# EAGLE design LED Leg (EAGLE 7.5.0)
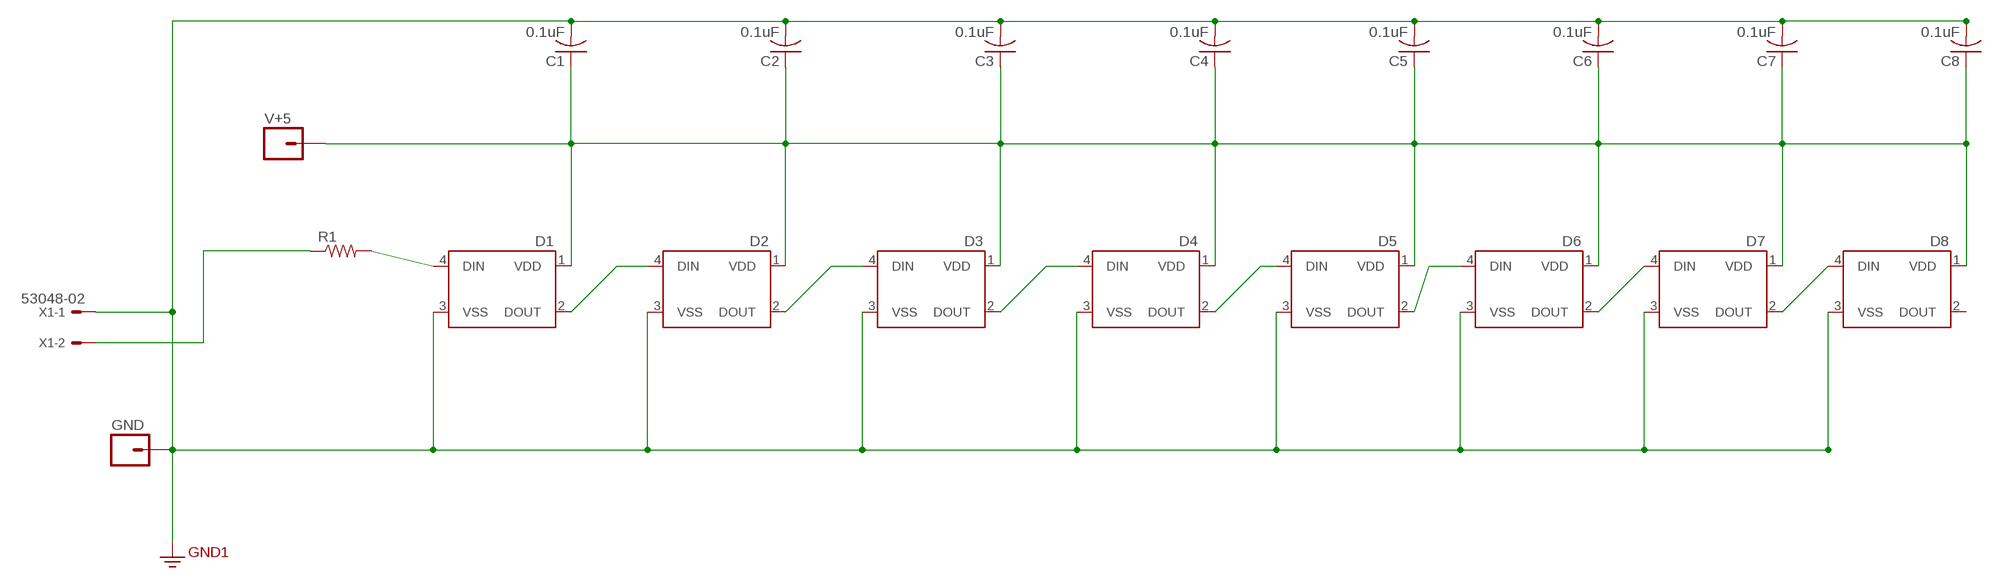
[diagram p0: schematic, sheet 1]

## Parts
C1  0.1uF  C-USC0603K  [C0603K]
C2  0.1uF  C-USC0603K  [C0603K]
C3  0.1uF  C-USC0603K  [C0603K]
C4  0.1uF  C-USC0603K  [C0603K]
C5  0.1uF  C-USC0603K  [C0603K]
C6  0.1uF  C-USC0603K  [C0603K]
C7  0.1uF  C-USC0603K  [C0603K]
C8  0.1uF  C-USC0603K  [C0603K]
D1  WS2812B  [WS2812B]
D2  WS2812B  [WS2812B]
D3  WS2812B  [WS2812B]
D4  WS2812B  [WS2812B]
D5  WS2812B  [WS2812B]
D6  WS2812B  [WS2812B]
D7  WS2812B  [WS2812B]
D8  WS2812B  [WS2812B]
GND  M01NOSILK-KIT  [1X01NS-KIT]
R1  R-US_R0603  [R0603]
V+5  M01NOSILK-KIT  [1X01NS-KIT]
X1  53048-02  [53048-02]

## Nets
+5VOLTSUPPLY: C1.1 C2.1 C3.1 C4.1 C5.1 C6.1 C7.1 C8.1 D1.1(VDD) D2.1(VDD) D3.1(VDD) D4.1(VDD) D5.1(VDD) D6.1(VDD) D7.1(VDD) D8.1(VDD) V+5.1
GROUND: C1.2 C2.2 C3.2 C4.2 C5.2 C6.2 C7.2 C8.2 D1.3(VSS) D2.3(VSS) D3.3(VSS) D4.3(VSS) D5.3(VSS) D6.3(VSS) D7.3(VSS) D8.3(VSS) GND.1 X1.1 ; supply symbol labelled GND2
LEDSIGNAL: D1.4(DIN) R1.2
LEDSIGNAL0: R1.1 X1.2
N$2: D6.2(DOUT) D7.4(DIN)
N$3: D7.2(DOUT) D8.4(DIN)
N$6: D3.2(DOUT) D4.4(DIN)
N$7: D4.2(DOUT) D5.4(DIN)
N$8: D5.2(DOUT) D6.4(DIN)
SIGNAL: D1.2(DOUT) D2.4(DIN)
SIGNAL1: D2.2(DOUT) D3.4(DIN)
Unconnected: D8.2(DOUT)

## Library data of the parts
C1-C8 = resistor:C-US: CAPACITOR, American symbol
D1-D8 = SparkFun-LED:WS2812B: WS2812B - Intelligent control LED integrated light source Technical Specifications: Power Supply Voltage (VDD): 3.5 to 5.3 V Input Voltage (VI): -0.5 to VDD+0.5 V Operating Junction Temperature (Topt): -25°C to +80°C Storage Temperature Range (Tstg): -55°C to +150°C; PROD_ID: DIO-12503
GND V+5 = SparkFun-Connectors-mod:M01: Header 1 Standard 1-pin 0.1" header. Use with straight break away headers (SKU : PRT-00116), right angle break away headers (PRT-00553), swiss pins (PRT-00743), machine pins (PRT-00117), and female headers (PRT-00115). SMTSO-256-ET is a "flush mount" nut for a 4-40 screw. The older package used to be too tight, and did not allow it to sit properly thru the drill hit. The latest (0.165DIA) fits nice and snug.
R1 = adafruit:R-US_: RESISTOR, American symbol
X1 = con-molex:53?-02: CONNECTOR wire to board 1.25 mm (.049 inch) pitch header; MF: MOLEX; MPN: 53048-0210; OC_FARNELL: 1012259; OC_NEWARK: 57H4718

## Net classes
0 default: clearance 0.205 mm

## Board
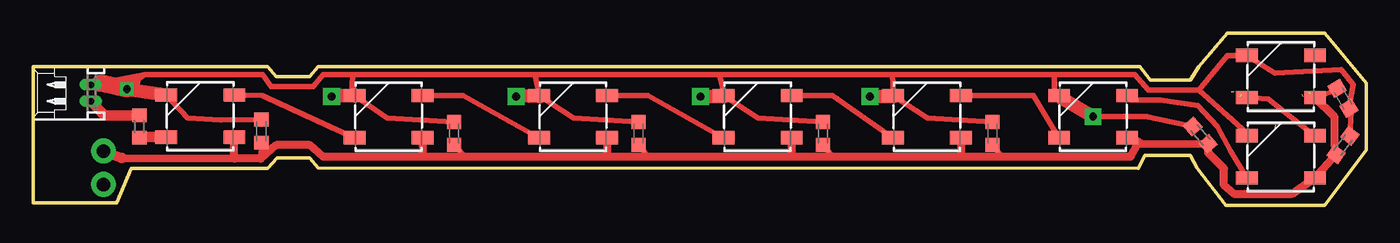
[diagram p1: board, top side]
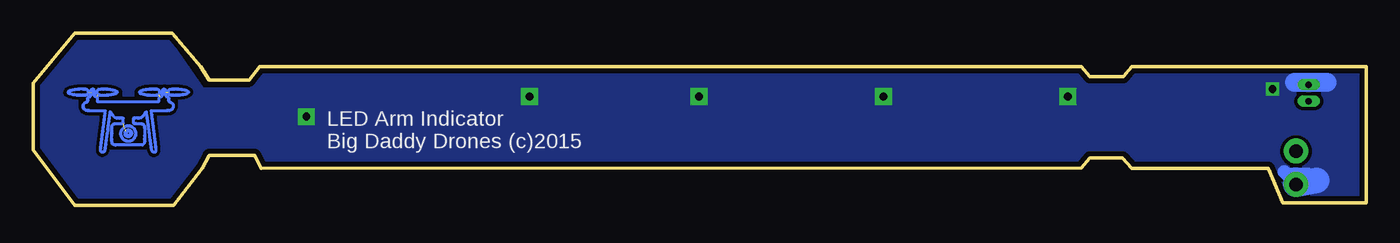
[diagram p2: board, bottom side, seen from below]

Size 100.97 x 13.08 mm. Coordinates in mm from the lower left corner, seen from the top.
Outline: 0,10.53 0,0.19 6.35,0.19 7.43,2.79 17.78,2.79 18.48,3.62 20.95,3.62 21.59,2.86 83.69,2.79 84.2,3.81 87.63,3.81 88.14,2.79 90.3,0 97.79,0 100.97,4.19 100.97,9.27 97.79,13.08 90.42,13.08 88.27,10.54 87.63,9.53 84.58,9.53 83.82,10.54 21.59,10.54 20.95,9.78 18.41,9.78 17.78,10.54 0,10.54
Copper layers (1*16): Top 0.0356mm / dielectric 1.5011mm / Bottom 0.0356mm
Design rules "LaenPCBOrder": minimum track width 6mil, minimum drill 13mil, track to track 6mil, track to pad 6mil, pad to pad 6mil, via to via 6mil, smd to smd 6mil, copper to edge 15mil, drill to drill 6mil, minimum pad ring 7mil, minimum via ring 7mil, stop-mask expansion 3mil, vias tented up to drill 0mil, thermal gap 10mil

### Footprints (pad centres in the part's own frame; a part is rotated, then mirrored left to right if it is on the bottom)
C0603K = smd 1.05 x 1.08: 1 -0.875,0; 2 0.875,0
WS2812B = smd 1.651 x 1: 1 -2.577,1.6; 2 -2.577,-1.6; 3 2.577,-1.6; 4 2.577,1.6
1X01NS-KIT = drill 1.016 pad 1.88: 1 0,0
R0603 = smd 1 x 1.1: 1 -0.85,0; 2 0.85,0
53048-02 = drill 0.5 pad 0.698 long: 1 0.625,-1.25; 2 -0.625,-1.25

### Placement (x,y rotation side)
C1  17.29,5.63 90 top
C2  31.88,5.46 90 top
C3  45.85,5.46 90 top
C4  59.82,5.46 90 top
C5  72.64,5.46 90 top
C6  88.39,5.33 131.4 top
C7  99.19,4.57 53.2 top
C8  99.19,8.13 300.9 top
D1  12.67,6.77 180 top
D2  26.92,6.73 180 top
D3  40.89,6.73 180 top
D4  54.86,6.73 180 top
D5  67.69,6.73 180 top
D6  80.26,6.73 180 top
D7  94.49,3.68 180 top
D8  94.49,9.78 180 top
GND  5.33,1.59 0 top
R1  8.05,5.99 270 top
V+5  5.33,4.13 0 top
X1  3.13,8.53 90 top

### Tracks (layer width: path | path; a pad name or v marks a point on that pad's centre or on a via)
+5VOLTSUPPLY
  Top 0.406: V+5.1 5.4,4.06 | C1.1 17.27,3.56 | C2.1 32.77,3.68 | C3.1 46.61,3.68 | C4.1 60.58,3.68 | C5.1 73.41,3.68 | D8.1 97.35,8.18 C8.1 | D7.1 97.32,2.34 | C7.1 98.79,3.95 98.55,4.57
  Top 0.61: 6.73,3.62 15.24,3.56 | 15.24,3.56 D1.1 | 15.24,3.56 17.27,3.56 18.41,4.57 20.95,4.57 21.97,3.68 29.5,3.68 | D2.1 29.5,3.68 | 29.5,3.68 32.77,3.68 43.47,3.68 | D3.1 43.47,3.68 | 43.47,3.68 46.61,3.68 57.44,3.68 | D4.1 57.44,3.68 | 57.44,3.68 60.58,3.68 70.27,3.68 | D5.1 70.27,3.68 | 70.27,3.68 73.41,3.68 83.09,3.68 83.73,4.8 | 83.73,4.8 83.95,4.7 C6.1 88.97,3.99 90.17,2.79 90.17,1.52 90.93,0.89 95.34,0.89 D7.1 | 97.32,2.34 C7.1 | 98.55,4.57 98.55,6.69 D8.1 | D6.1 83.28,5.13 83.73,4.8
  Top 0.813: 5.4,4.06 6.73,3.62
BDDRONE  (3 unrouted)
  Bottom 0.225: 95.61,6.2 95.59,6.29 95.58,6.37 95.57,6.46 95.56,6.55 95.55,6.64 95.54,6.72 95.53,6.81 95.51,6.99 95.5,7.07 95.49,7.16 95.58,7.16 95.66,7.16 95.75,7.16 95.84,7.17 95.92,7.17 96.01,7.17 96.09,7.17 96.18,7.17 96.26,7.17 96.35,7.18 96.43,7.18 96.51,7.18 96.6,7.18 96.68,7.18 96.76,7.18 96.84,7.19 96.93,7.21 97.01,7.23 97.08,7.28 97.12,7.36 97.15,7.44 97.16,7.53 97.15,7.61 97.12,7.7 97.07,7.77 97,7.82 96.92,7.85 96.84,7.87 96.81,7.94 96.81,8.02 96.81,8.1 96.81,8.18 96.75,8.23 96.68,8.25 96.6,8.27 96.59,8.35 96.58,8.43 96.58,8.51 96.57,8.59 96.57,8.67 96.57,8.75 96.52,8.81 96.44,8.84 96.37,8.82 96.36,8.74 96.35,8.66 96.35,8.59 96.35,8.51 96.34,8.43 96.34,8.35 96.31,8.28 96.24,8.24 96.16,8.24 96.11,8.18 96.1,8.1 96.09,8.03 96.09,7.95 96.09,7.87 91.55,7.87 91.47,7.86 91.42,7.92 91.41,8 91.41,8.08 91.41,8.16 91.36,8.22 91.29,8.25 91.21,8.26 91.18,8.34 91.17,8.41 91.17,8.49 91.16,8.57 91.16,8.65 91.16,8.73 91.13,8.8 91.06,8.84 | 96.89,8.4 96.83,8.44 96.78,8.5 96.77,8.58 96.77,8.65 96.8,8.73 96.86,8.78 96.93,8.8 97.02,8.81 97.11,8.82 97.19,8.82 97.28,8.83 97.37,8.83 97.45,8.82 97.54,8.82 97.63,8.81 97.72,8.79 97.8,8.78 97.89,8.76 97.97,8.75 98.06,8.73 98.14,8.71 98.22,8.68 98.29,8.64 98.33,8.57 98.26,8.52 98.18,8.49 98.1,8.47 98.02,8.45 97.93,8.43 97.84,8.41 97.76,8.4 97.67,8.39 97.58,8.38 97.5,8.38 97.41,8.38 97.32,8.38 97.24,8.38 97.15,8.38 97.06,8.38 96.98,8.39 96.89,8.39 | 91.61,8.38 91.54,8.38 91.46,8.41 91.4,8.46 91.37,8.53 91.37,8.61 91.38,8.69 91.44,8.76 91.52,8.79 91.6,8.81 91.69,8.82 91.77,8.82 91.86,8.82 91.94,8.82 92.03,8.82 92.11,8.81 92.2,8.8 92.28,8.8 92.37,8.79 92.45,8.77 92.53,8.76 92.62,8.74 92.7,8.72 92.78,8.69 92.86,8.66 92.92,8.61 92.88,8.54 92.8,8.5 92.72,8.48 92.64,8.45 92.56,8.43 92.47,8.42 92.39,8.4 92.3,8.39 92.22,8.38 92.13,8.37 92.04,8.37 91.96,8.36 91.87,8.36 91.79,8.37 91.7,8.37 91.61,8.38
  Bottom 0.225: 95.35,8.38 95.27,8.39 95.19,8.4 95.11,8.41 95.03,8.42 94.95,8.43 94.87,8.45 94.79,8.47 94.71,8.5 94.64,8.54 94.57,8.59 94.62,8.65 94.69,8.68 94.77,8.71 94.85,8.73 94.93,8.75 95.02,8.77 95.1,8.78 95.19,8.79 95.28,8.8 95.37,8.81 95.45,8.81 95.54,8.82 95.63,8.82 95.72,8.81 95.81,8.81 95.89,8.81 95.98,8.8 96.06,8.77 96.12,8.71 96.14,8.63 96.14,8.55 96.11,8.47 96.05,8.41 95.97,8.39 95.88,8.38 95.79,8.37 95.7,8.37 95.62,8.37 95.53,8.37 95.44,8.37 95.35,8.38
GROUND  (via drill 0.6 pad 1.02, 0.6 pad 1.27)
  Top 0.406: 8.46,9.91 5.08,9.27 4.55,9.33 X1.1 | 22.61,8.33 24.13,8.26 24.18,9.91 | 24.18,9.91 21.97,9.91 21.21,9.02 18.03,9.02 17.4,9.91 8.46,9.91 | 36.58,8.33 D3.3 40.91,6.63 C3.2 | 38.35,8.26 38.02,9.91 | 38.02,9.91 24.18,9.91 | v50.55,8.26 50.55,8.33 D4.3 54.88,6.63 C4.2 | 52.32,8.26 52.32,8.51 51.99,9.91 | 51.99,9.91 38.02,9.91 | v63.37,8.26 63.37,8.33 D5.3 67.7,6.63 C5.2 | 65.15,8.26 65.15,8.51 65.08,9.91 | 65.08,9.91 51.99,9.91 | 77.85,8.13 77.85,8.33 D6.3 79.9,6.76 84.33,6.73 84.45,6.72 C6.2 | 77.34,9.91 65.08,9.91 | C1.2 14.22,6.48 11.7,6.63 D1.3 9.84,8.36 9.59,8.45 | C2.2 26.81,6.63 D2.3 24.35,8 | 77.34,9.91 77.34,8.64 | 8.46,9.91 7.75,9.4 | 88.27,8.76 84.45,8.76 83.44,9.91 77.34,9.91 | 88.27,8.76 90.42,11.38 D8.3 94.02,10.03 99.06,10.29 99.96,9.16 C8.2 99.84,7.68 C7.2 | D7.3 91.91,5.5 88.27,8.76
  Top 0.813: 7.75,9.4 6.48,8.7 6.99,8.83
  Top 1.016: D2.3 22.61,8.33 | 36.58,8.33 38.35,8.26 | v50.55,8.26 52.32,8.26 | v63.37,8.26 65.15,8.26 | 77.85,8.13 v80.26,6.73 | 6.99,8.83 9.59,8.45
  Top 1.27: v7.11,8.83 5.08,9.27
  Bottom 0.406: 4.38,2.67 6.22,2.67
  Bottom 1.016: 5.33,1.71 6.22,2.54
  Bottom 1.422: 2.98,9.33 5.46,9.33
  Bottom 1.93: GND.1 3.75,1.9
  other vias: 22.61,8.26 36.58,8.26
  pour Bottom (isolate 0.254): 0.38,10.16 0.38,0.38 6.1,0.44 7.3,3.11 17.53,3.3 18.41,4.19 21.34,4.19 22.1,3.3 83.19,3.3 83.69,4.19 88.01,4.19 89.41,2.29 90.68,0.64 97.54,0.64 99.95,3.56 100.46,4.32 100.58,8.89 97.54,12.57 90.81,12.57 88.14,8.76 84.45,8.76 83.44,10.16 21.72,10.16 21.3,9.21 18.13,9.21 17.53,10.16
LEDSIGNAL
  Top 0.61: 8.05,5.17 R1.2
  Top 0.813: D1.4 8.05,5.17
LEDSIGNAL0
  Top 0.813: X1.2 5.45,6.84 R1.1
N$2
  Top 0.406: D6.2 83.17,8 85.34,8 88.19,7.57 89.66,5.97 90.68,4.08 D7.4
N$3
  Top 0.406: D7.2 93.54,8.08 D8.4
N$6
  Top 0.406: D3.2 46.55,8.33 D4.4
N$7
  Top 0.406: D4.2 60.52,8.33 D5.4
N$8
  Top 0.406: D5.2 75.76,8.33 D6.4
S$1  (3 unrouted)
  Bottom 0.225: 95.62,6.11 95.63,6.02 95.64,5.94 95.65,5.85 95.66,5.76 95.67,5.67 95.69,5.59 95.7,5.5 95.71,5.41 95.72,5.32 95.73,5.24 95.74,5.15 95.75,5.06 95.76,4.97 95.77,4.89 95.78,4.8 95.8,4.71 95.81,4.62 95.82,4.45 95.83,4.36 95.84,4.27 95.85,4.18 95.84,4.11 95.79,4.05 95.71,4.03 95.63,4.04 95.57,4.08 95.54,4.16 95.53,4.24 95.52,4.33 95.5,4.42 95.49,4.51 95.48,4.59 95.47,4.68 95.45,4.77 95.44,4.85 95.43,4.94 95.42,5.03 95.41,5.12 95.4,5.2 95.38,5.29 95.37,5.38 95.36,5.47 95.33,5.73 95.31,5.81 95.29,5.99 95.28,6.08 95.27,6.16 95.26,6.25 95.24,6.34 95.23,6.43 95.22,6.51 95.2,6.6 95.19,6.69 95.18,6.77 95.17,6.86 95.15,6.95 95.14,7.03 95.12,7.12 95.06,7.06 95.01,6.98 94.96,6.91 94.91,6.83 94.86,6.76 94.8,6.69 94.73,6.64 94.64,6.63 94.56,6.62 94.47,6.62 94.39,6.61 94.3,6.61 94.22,6.61 94.13,6.61 94.13,6.22 94.22,6.22 94.31,6.21 94.39,6.21 94.48,6.21 94.56,6.21 94.65,6.2 94.73,6.2 94.82,6.18 94.9,6.16 94.95,6.1 94.98,6.03 95,5.95 95,5.88 95,5.8 95,5.72 95,5.64 95,5.56 95,5.47 95,5.39 95.01,5.31 95.01,5.22 95.01,5.14 95.01,5.05 95,4.97 95,4.88 94.98,4.8 94.97,4.72 94.92,4.64 94.85,4.6 94.76,4.58 94.67,4.58 92.67,4.58 92.61,4.63 92.56,4.69 92.53,4.77 92.52,4.85 92.51,4.93 92.51,5.01 92.51,5.09 92.51,5.17 92.51,5.26 92.51,5.34 92.51,5.43 92.51,5.51 92.5,5.6 92.5,5.68 92.51,5.77 92.51,5.85 92.52,5.93 92.53,6.02 92.55,6.1 92.61,6.15 92.69,6.19 92.77,6.2 92.86,6.2 92.94,6.2 93.02,6.21 93.11,6.21 93.19,6.22 93.27,6.21 93.34,6.22 93.38,6.28 93.38,6.61 93.3,6.61 93.22,6.61 93.06,6.61 92.98,6.62 92.9,6.62 92.82,6.63 92.74,6.65 92.69,6.72 92.64,6.78 92.59,6.85 92.54,6.92 92.5,6.99 92.44,7.06 92.39,7.12 92.37,7.03 92.36,6.95 92.35,6.86 92.33,6.77 92.32,6.68 92.31,6.59 92.29,6.5 92.28,6.41 92.27,6.33 92.25,6.24 92.24,6.15 92.23,6.06 92.22,5.97 92.21,5.88 92.19,5.79 92.18,5.7 92.17,5.62 92.16,5.53 92.15,5.44 92.14,5.35 92.11,5.17 92.09,5 92.08,4.91 92.06,4.82 92.05,4.73 92.04,4.64 92.03,4.55 92.01,4.46 92,4.38 91.99,4.29 91.97,4.2 91.95,4.13 91.91,4.07 91.85,4.03 91.78,4.03 91.71,4.05 91.67,4.13 91.66,4.21 91.67,4.3 91.68,4.38 91.69,4.47 91.7,4.55 91.71,4.64 91.72,4.73 91.73,4.81 91.74,4.9 91.75,4.99 91.76,5.07 91.77,5.16 91.78,5.25 91.79,5.34 91.81,5.42 91.82,5.51 91.83,5.6 91.84,5.68 91.85,5.77 91.86,5.86 91.87,5.94 91.88,6.03 91.89,6.12 91.91,6.2 91.92,6.29 91.93,6.38 91.94,6.46 91.95,6.55 91.96,6.64 91.97,6.73 91.98,6.81 91.99,6.9 92,6.99 92.01,7.07 92.02,7.16 91.94,7.16 91.85,7.17 91.76,7.17 91.68,7.17 91.59,7.17 91.42,7.17 91.33,7.17 91.25,7.17 91.16,7.17 91.08,7.17 90.99,7.18 90.91,7.18 90.82,7.18 90.73,7.19 90.65,7.2 90.56,7.2 90.49,7.24 90.42,7.3 90.38,7.37 90.36,7.45 90.35,7.53 90.36,7.62 90.39,7.7 90.44,7.76 90.5,7.82 90.58,7.85 90.66,7.87 90.69,7.93 90.7,8.01 90.71,8.09 90.71,8.17 90.75,8.23 90.83,8.25 90.9,8.27 90.92,8.35 90.93,8.43 90.94,8.51 90.94,8.59 90.94,8.67 90.95,8.74 90.98,8.82 91.06,8.84
  Bottom 0.225: 93.21,5.23 93.27,5.13 93.34,5.05 93.43,4.98 93.53,4.92 93.64,4.89 93.75,4.89 | 93.21,5.23 93.25,5.16 93.29,5.1 93.34,5.05 93.4,5 93.47,4.96 93.53,4.92 93.61,4.9 93.68,4.89 93.75,4.89 | 93.21,5.23 93.19,5.3 93.17,5.37 93.17,5.53 93.19,5.6 93.21,5.67 | 93.75,4.89 93.83,4.89 93.9,4.9 93.98,4.93 94.05,4.96 94.11,5 94.17,5.05 | 93.75,4.89 93.87,4.89 93.97,4.93 94.08,4.98 94.17,5.05 | 93.21,5.23 93.17,5.34 93.16,5.45 93.17,5.57 93.21,5.67 | 93.21,5.67 93.25,5.74 93.29,5.8 93.34,5.85 93.4,5.9 93.47,5.95 93.53,5.98 93.61,6 93.68,6.02 93.75,6.02 | 94.17,5.05 94.22,5.11 94.26,5.17 94.3,5.23 | 94.17,5.05 94.24,5.13 94.3,5.23 | 93.21,5.67 93.27,5.77 93.34,5.85 93.43,5.93 93.53,5.98 93.64,6.01 93.75,6.02 | 94.3,5.23 94.33,5.3 94.34,5.37 94.34,5.45 | 94.3,5.23 94.33,5.34 94.34,5.45 | 94.34,5.45 94.34,5.53 94.33,5.6 94.3,5.67 | 94.34,5.45 94.33,5.57 94.3,5.67 | 93.75,6.02 93.87,6.01 93.97,5.97 94.08,5.93 94.17,5.85 | 94.3,5.67 94.26,5.73 94.22,5.8 94.17,5.85 | 94.3,5.67 94.24,5.77 94.17,5.85 | 93.75,6.02 93.83,6.02 93.9,6 93.98,5.97 94.05,5.95 94.11,5.9 94.17,5.85 | 89.76,8.4 89.67,8.41 89.58,8.43 89.49,8.44 89.41,8.46 89.32,8.49 89.24,8.54 89.17,8.59 89.24,8.64 89.31,8.68 89.39,8.71 89.47,8.74 89.55,8.75 89.63,8.77 89.71,8.78 89.79,8.8 89.88,8.8 89.96,8.81 90.04,8.82 90.12,8.82 90.2,8.82 90.28,8.82 90.36,8.82 90.45,8.81 90.53,8.81 90.61,8.79 90.68,8.75 90.73,8.68 90.75,8.6 90.73,8.52 90.69,8.45 90.62,8.4 90.54,8.38 90.45,8.38 90.36,8.38 90.28,8.38 90.19,8.38 90.1,8.38 90.02,8.38 89.93,8.38 89.84,8.39 89.76,8.4
  Bottom 0.286: 93.97,5.44 93.95,5.38 93.94,5.36 93.92,5.33 93.9,5.32 93.88,5.3 93.86,5.28 93.83,5.27 93.8,5.26 93.78,5.25 93.72,5.25 93.69,5.26 93.67,5.27 93.64,5.28 93.62,5.3 93.6,5.31 93.58,5.33 93.56,5.36 93.55,5.38 93.53,5.41 93.53,5.44 93.53,5.47 93.53,5.49 93.53,5.52 93.55,5.54 93.56,5.57 93.58,5.59 93.6,5.61 93.62,5.64 93.64,5.65 93.67,5.66 93.69,5.67 93.72,5.67 93.75,5.68 93.78,5.67 93.8,5.67 93.83,5.66 93.86,5.65 93.88,5.63 93.9,5.61 93.92,5.59 93.94,5.57 93.95,5.54 93.96,5.52 93.97,5.49 93.97,5.44
SIGNAL
  Top 0.406: D1.2 17.34,8.33 D2.4
SIGNAL1
  Top 0.406: D2.2 32.58,8.33 D3.4

### Text on the board
bNames: LED Arm Indicator / Big Daddy Drones (c)2015